# Altium project lyaptsev_control_board.PrjPcb
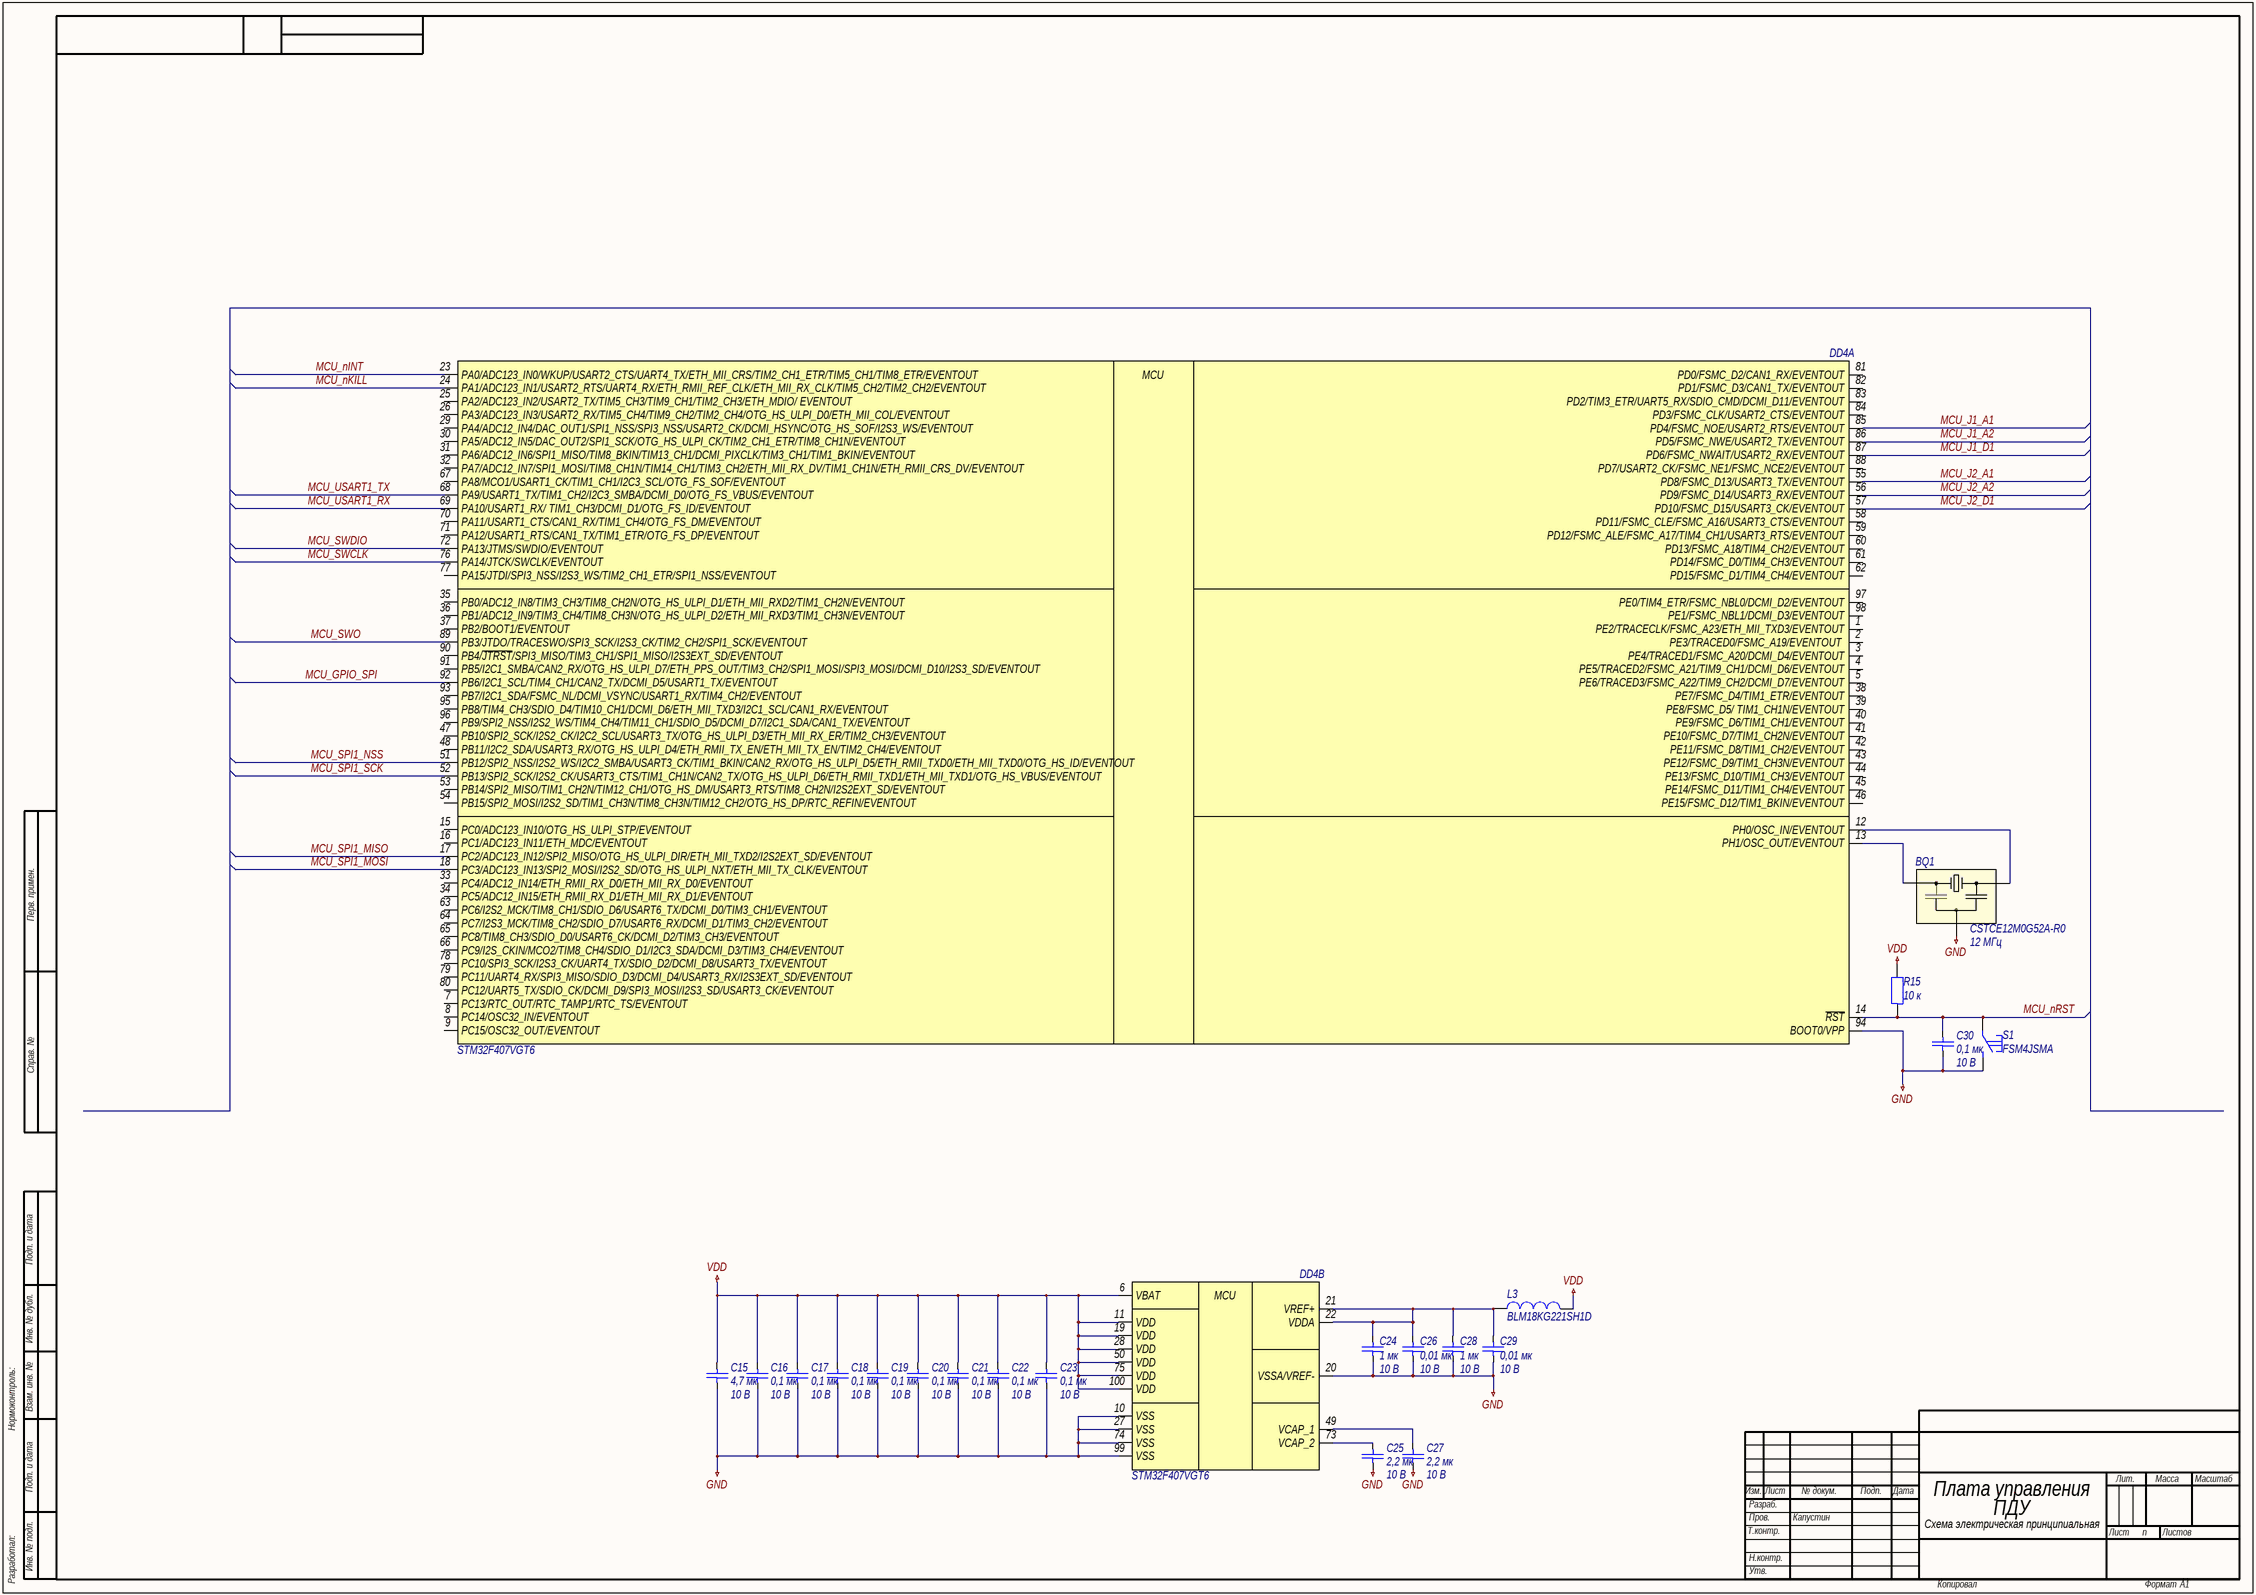
[diagram p0: lyaptsev_control_board_1.SchDoc]
approver: Капустин; check: Капустин; designation: СПБПУ.3331506.016; developer: Ляпцев; document_code: Ý3; document_type: Схема электрическая принципиальная; pcb_dec_number: СПБПУ.3331506.016; project: Плата управления ПДУ; sheets_total: 2; title: Плата управления ПДУ; title_line_1: Плата управления; title_line_2: ПДУ
2 sheets, 68 parts. Net scope: global (net labels, ports and power ports of the same name join across sheets).
Board file: lyaptsev_control_board.PcbDoc
Sheets:
  lyaptsev_control_board_1.SchDoc
  lyaptsev_control_board_2.SchDoc

## Sheet lyaptsev_control_board_1.SchDoc: Плата управления ПДУ
size 840 x 594 mm; ApprovedBy: Капустин; CheckedBy: Капустин; DrawnBy: Ляпцев; DocumentNumber: СПБПУ.3331506.016Ý3; SheetNumber: n; SheetTotal: 2; DocumentCode: Ý3; ImagePath: СПБПУ.3331506.016

### Parts
BQ1  CSTCE12M0G52A-R0  Частотa: 12 МГц  [CSTCE-3-320X130X70]
C15  4,7 мк  Напряжение: 10 В  [C0805]
C16  0,1 мк  Напряжение: 10 В  [C0603]
C17  0,1 мк  Напряжение: 10 В  [C0603]
C18  0,1 мк  Напряжение: 10 В  [C0603]
C19  0,1 мк  Напряжение: 10 В  [C0603]
C20  0,1 мк  Напряжение: 10 В  [C0603]
C21  0,1 мк  Напряжение: 10 В  [C0603]
C22  0,1 мк  Напряжение: 10 В  [C0603]
C23  0,1 мк  Напряжение: 10 В  [C0603]
C24  1 мк  Напряжение: 10 В  [C0603]
C25  2,2 мк  Напряжение: 10 В  [C0603]
C26  0,01 мк  Напряжение: 10 В  [C0603]
C27  2,2 мк  Напряжение: 10 В  [C0603]
C28  1 мк  Напряжение: 10 В  [C0603]
C29  0,01 мк  Напряжение: 10 В  [C0603]
C30  0,1 мк  Напряжение: 10 В  [C0603]
DD4  STM32F407VGT6  [LQFP-100-P50-1400X1400X160-L60X22]  (parts A,B of 2)
L3  BLM18KG221SH1D  [BLM-2-0603]
R15  10 к  [R0603]
S1  FSM4JSMA  [FSM4JSMA]

### Nets
GND: BQ1.2 C15.2 C16.2 C17.2 C18.2 C19.2 C20.2 C21.2 C22.2 C23.2 C24.2 C25.2 C26.2 C27.2 C28.2 C29.2 C30.2 DD4.10(VSS) DD4.20(VSSA/VREF-) DD4.27(VSS) DD4.74(VSS) DD4.94(BOOT0/VPP) DD4.99(VSS) S1.2
VDD: C15.1 C16.1 C17.1 C18.1 C19.1 C20.1 C21.1 C22.1 C23.1 DD4.6(VBAT) DD4.11(VDD) DD4.19(VDD) DD4.28(VDD) DD4.50(VDD) DD4.75(VDD) DD4.100(VDD) L3.2 R15.2
MCU_GPIO_SPI: DD4.92(PB6/I2C1_SCL/TIM4_CH1/CAN2_TX/DCMI_D5/USART1_TX/EVENTOUT)
MCU_J1_A1: DD4.85(PD4/FSMC_NOE/USART2_RTS/EVENTOUT)
MCU_J1_A2: DD4.86(PD5/FSMC_NWE/USART2_TX/EVENTOUT)
MCU_J1_D1: DD4.87(PD6/FSMC_NWAIT/USART2_RX/EVENTOUT)
MCU_J2_A1: DD4.55(PD8/FSMC_D13/USART3_TX/EVENTOUT)
MCU_J2_A2: DD4.56(PD9/FSMC_D14/USART3_RX/EVENTOUT)
MCU_J2_D1: DD4.57(PD10/FSMC_D15/USART3_CK/EVENTOUT)
MCU_nINT: DD4.23(PA0/ADC123_IN0/WKUP/USART2_CTS/UART4_TX/ETH_MII_CRS/TIM2_CH1_ETR/TIM5_CH1/TIM8_ETR/EVENTOUT)
MCU_nKILL: DD4.24(PA1/ADC123_IN1/USART2_RTS/UART4_RX/ETH_RMII_REF_CLK/ETH_MII_RX_CLK/TIM5_CH2/TIM2_CH2/EVENTOUT)
MCU_nRST: C30.1 DD4.14(~{RST}) R15.1 S1.1
MCU_SPI1_MISO: DD4.17(PC2/ADC123_IN12/SPI2_MISO/OTG_HS_ULPI_DIR/ETH_MII_TXD2/I2S2EXT_SD/EVENTOUT)
MCU_SPI1_MOSI: DD4.18(PC3/ADC123_IN13/SPI2_MOSI/I2S2_SD/OTG_HS_ULPI_NXT/ETH_MII_TX_CLK/EVENTOUT)
MCU_SPI1_NSS: DD4.51(PB12/SPI2_NSS/I2S2_WS/I2C2_SMBA/USART3_CK/TIM1_BKIN/CAN2_RX/OTG_HS_ULPI_D5/ETH_RMII_TXD0/ETH_MII_TXD0/OTG_HS_ID/EVENTOUT)
MCU_SPI1_SCK: DD4.52(PB13/SPI2_SCK/I2S2_CK/USART3_CTS/TIM1_CH1N/CAN2_TX/OTG_HS_ULPI_D6/ETH_RMII_TXD1/ETH_MII_TXD1/OTG_HS_VBUS/EVENTOUT)
MCU_SWCLK: DD4.76(PA14/JTCK/SWCLK/EVENTOUT)
MCU_SWDIO: DD4.72(PA13/JTMS/SWDIO/EVENTOUT)
MCU_SWO: DD4.89(PB3/JTDO/TRACESWO/SPI3_SCK/I2S3_CK/TIM2_CH2/SPI1_SCK/EVENTOUT)
MCU_USART1_RX: DD4.69(PA10/USART1_RX/_TIM1_CH3/DCMI_D1/OTG_FS_ID/EVENTOUT)
MCU_USART1_TX: DD4.68(PA9/USART1_TX/TIM1_CH2/I2C3_SMBA/DCMI_D0/OTG_FS_VBUS/EVENTOUT)
NetBQ1_1: BQ1.1 DD4.12(PH0/OSC_IN/EVENTOUT)
NetBQ1_3: BQ1.3 DD4.13(PH1/OSC_OUT/EVENTOUT)
NetC24_1: C24.1 C26.1 C28.1 C29.1 DD4.21(VREF+) DD4.22(VDDA) L3.1
NetC25_1: C25.1 DD4.73(VCAP_2)
NetC27_1: C27.1 DD4.49(VCAP_1)

Not connected (* = marked no-connect by the designer): DD4 1(PE2/TRACECLK/FSMC_A23/ETH_MII_TXD3/EVENTOUT) 2(PE3/TRACED0/FSMC_A19/EVENTOUT_) 3(PE4/TRACED1/FSMC_A20/DCMI_D4/EVENTOUT) 4(PE5/TRACED2/FSMC_A21/TIM9_CH1/DCMI_D6/EVENTOUT) 5(PE6/TRACED3/FSMC_A22/TIM9_CH2/DCMI_D7/EVENTOUT) 7(PC13/RTC_OUT/RTC_TAMP1/RTC_TS/EVENTOUT) 8(PC14/OSC32_IN/EVENTOUT) 9(PC15/OSC32_OUT/EVENTOUT) 15(PC0/ADC123_IN10/OTG_HS_ULPI_STP/EVENTOUT) 16(PC1/ADC123_IN11/ETH_MDC/EVENTOUT) 25(PA2/ADC123_IN2/USART2_TX/TIM5_CH3/TIM9_CH1/TIM2_CH3/ETH_MDIO/_EVENTOUT_) 26(PA3/ADC123_IN3/USART2_RX/TIM5_CH4/TIM9_CH2/TIM2_CH4/OTG_HS_ULPI_D0/ETH_MII_COL/EVENTOUT) 29(PA4/ADC12_IN4/DAC_OUT1/SPI1_NSS/SPI3_NSS/USART2_CK/DCMI_HSYNC/OTG_HS_SOF/I2S3_WS/EVENTOUT) 30(PA5/ADC12_IN5/DAC_OUT2/SPI1_SCK/OTG_HS_ULPI_CK/TIM2_CH1_ETR/TIM8_CH1N/EVENTOUT) 31(PA6/ADC12_IN6/SPI1_MISO/TIM8_BKIN/TIM13_CH1/DCMI_PIXCLK/TIM3_CH1/TIM1_BKIN/EVENTOUT) 32(PA7/ADC12_IN7/SPI1_MOSI/TIM8_CH1N/TIM14_CH1/TIM3_CH2/ETH_MII_RX_DV/TIM1_CH1N/ETH_RMII_CRS_DV/EVENTOUT) 33(PC4/ADC12_IN14/ETH_RMII_RX_D0/ETH_MII_RX_D0/EVENTOUT) 34(PC5/ADC12_IN15/ETH_RMII_RX_D1/ETH_MII_RX_D1/EVENTOUT) 35(PB0/ADC12_IN8/TIM3_CH3/TIM8_CH2N/OTG_HS_ULPI_D1/ETH_MII_RXD2/TIM1_CH2N/EVENTOUT) 36(PB1/ADC12_IN9/TIM3_CH4/TIM8_CH3N/OTG_HS_ULPI_D2/ETH_MII_RXD3/TIM1_CH3N/EVENTOUT) 37(PB2/BOOT1/EVENTOUT) 38(PE7/FSMC_D4/TIM1_ETR/EVENTOUT) 39(PE8/FSMC_D5/_TIM1_CH1N/EVENTOUT) 40(PE9/FSMC_D6/TIM1_CH1/EVENTOUT) 41(PE10/FSMC_D7/TIM1_CH2N/EVENTOUT) 42(PE11/FSMC_D8/TIM1_CH2/EVENTOUT) 43(PE12/FSMC_D9/TIM1_CH3N/EVENTOUT) 44(PE13/FSMC_D10/TIM1_CH3/EVENTOUT) 45(PE14/FSMC_D11/TIM1_CH4/EVENTOUT) 46(PE15/FSMC_D12/TIM1_BKIN/EVENTOUT) 47(PB10/SPI2_SCK/I2S2_CK/I2C2_SCL/USART3_TX/OTG_HS_ULPI_D3/ETH_MII_RX_ER/TIM2_CH3/EVENTOUT) 48(PB11/I2C2_SDA/USART3_RX/OTG_HS_ULPI_D4/ETH_RMII_TX_EN/ETH_MII_TX_EN/TIM2_CH4/EVENTOUT) 53(PB14/SPI2_MISO/TIM1_CH2N/TIM12_CH1/OTG_HS_DM/USART3_RTS/TIM8_CH2N/I2S2EXT_SD/EVENTOUT) 54(PB15/SPI2_MOSI/I2S2_SD/TIM1_CH3N/TIM8_CH3N/TIM12_CH2/OTG_HS_DP/RTC_REFIN/EVENTOUT) 58(PD11/FSMC_CLE/FSMC_A16/USART3_CTS/EVENTOUT) 59(PD12/FSMC_ALE/FSMC_A17/TIM4_CH1/USART3_RTS/EVENTOUT) 60(PD13/FSMC_A18/TIM4_CH2/EVENTOUT) 61(PD14/FSMC_D0/TIM4_CH3/EVENTOUT) 62(PD15/FSMC_D1/TIM4_CH4/EVENTOUT) 63(PC6/I2S2_MCK/TIM8_CH1/SDIO_D6/USART6_TX/DCMI_D0/TIM3_CH1/EVENTOUT) 64(PC7/I2S3_MCK/TIM8_CH2/SDIO_D7/USART6_RX/DCMI_D1/TIM3_CH2/EVENTOUT) 65(PC8/TIM8_CH3/SDIO_D0/USART6_CK/DCMI_D2/TIM3_CH3/EVENTOUT_) 66(PC9/I2S_CKIN/MCO2/TIM8_CH4/SDIO_D1/I2C3_SDA/DCMI_D3/TIM3_CH4/EVENTOUT) 67(PA8/MCO1/USART1_CK/TIM1_CH1/I2C3_SCL/OTG_FS_SOF/EVENTOUT) 70(PA11/USART1_CTS/CAN1_RX/TIM1_CH4/OTG_FS_DM/EVENTOUT) 71(PA12/USART1_RTS/CAN1_TX/TIM1_ETR/OTG_FS_DP/EVENTOUT) 77(PA15/JTDI/SPI3_NSS/I2S3_WS/TIM2_CH1_ETR/SPI1_NSS/EVENTOUT) 78(PC10/SPI3_SCK/I2S3_CK/UART4_TX/SDIO_D2/DCMI_D8/USART3_TX/EVENTOUT_) 79(PC11/UART4_RX/SPI3_MISO/SDIO_D3/DCMI_D4/USART3_RX/I2S3EXT_SD/EVENTOUT) 80(PC12/UART5_TX/SDIO_CK/DCMI_D9/SPI3_MOSI/I2S3_SD/USART3_CK/EVENTOUT) 81(PD0/FSMC_D2/CAN1_RX/EVENTOUT) 82(PD1/FSMC_D3/CAN1_TX/EVENTOUT) 83(PD2/TIM3_ETR/UART5_RX/SDIO_CMD/DCMI_D11/EVENTOUT) 84(PD3/FSMC_CLK/USART2_CTS/EVENTOUT) 88(PD7/USART2_CK/FSMC_NE1/FSMC_NCE2/EVENTOUT) 90(PB4/~{JTRST}/SPI3_MISO/TIM3_CH1/SPI1_MISO/I2S3EXT_SD/EVENTOUT) 91(PB5/I2C1_SMBA/CAN2_RX/OTG_HS_ULPI_D7/ETH_PPS_OUT/TIM3_CH2/SPI1_MOSI/SPI3_MOSI/DCMI_D10/I2S3_SD/EVENTOUT) 93(PB7/I2C1_SDA/FSMC_NL/DCMI_VSYNC/USART1_RX/TIM4_CH2/EVENTOUT) 95(PB8/TIM4_CH3/SDIO_D4/TIM10_CH1/DCMI_D6/ETH_MII_TXD3/I2C1_SCL/CAN1_RX/EVENTOUT) 96(PB9/SPI2_NSS/I2S2_WS/TIM4_CH4/TIM11_CH1/SDIO_D5/DCMI_D7/I2C1_SDA/CAN1_TX/EVENTOUT) 97(PE0/TIM4_ETR/FSMC_NBL0/DCMI_D2/EVENTOUT) 98(PE1/FSMC_NBL1/DCMI_D3/EVENTOUT)

### Notes on the sheet
- Перв. примен.
- Справ. №
- Подп. и дата
- Инв. № дубл.
- Нормоконтроль:
- Взам. инв. №
- Изм.
- Лист
- № докум.
- Подп.
- Дата
- Лит.
- Масса
- Масштаб
- Т.контр.
- Пров.
- Разраб.
- Листов
- Разработал:
- Инв. № подл.
- Н.контр.
- Утв.
- Копировал
- Формат
- А1
- (in symbol dd0001, part A) MCU
- (in symbol dd0001, part B) MCU

### Library data of the parts
BQ1 = bq0001: =Описание; ID: bq0001; Фамилия: Самарин; Описание: Кварцевый резонатор 12 МГц; Производитель: Murata Manufacturing Co., Ltd.; Корпус: 3,20 x 1,30 x 0,70; Наименование: CSTCE12M0G52A-R0; Частота: 12 МГц; HelpURL: https://www.murata.com/en-us/products/productdetail?partno=CSTCE12M0G52A-R0
C15 = c0108: =Описание; ID: c0108; Фамилия: Паньков; Описание: Конденсатор керамический чип 0805 4,7 мкФ 10 В ±10 %; Наименование: CC0805KKX7R6BB475; Производитель: YAGEO Corp.; Отклонение: ±10 %; Рабочие температуры: от –55 °С до +125 °С; Температурный коэффициент емкости: X7R; Корпус: 0805; Номинал: 4,7 мк; Номинальное напряжение: 10 В; HelpURL: https://www.yageo.com/upload/media/product/productsearch/datasheet/mlcc/UPY-GPHC_X7R_6.3V-to-50V_20.pdf
C16-C23 = c0054: =Описание; ID: c0054; Фамилия: Паньков; Описание: Конденсатор керамический чип 0603 100 нФ 10 В ±10 %; Наименование: CC0603KRX7R6BB104; Производитель: YAGEO Corp.; Отклонение: ±10 %; Рабочие температуры: от –55 °С до +125 °С; Температурный коэффициент емкости: X7R; Корпус: 0603; Номинал: 0,1 мк; Номинальное напряжение: 10 В; HelpURL: https://www.yageo.com/upload/media/product/productsearch/datasheet/mlcc/UPY-GPHC_X7R_6.3V-to-50V_20.pdf
C24 C28 = c0086: =Описание; ID: c0086; Фамилия: Паньков; Описание: Конденсатор керамический чип 0603 1 мкФ 10 В ±10 %; Наименование: CC0603KRX7R6BB105; Производитель: YAGEO Corp.; Отклонение: ±10 %; Рабочие температуры: от –55 °С до +125 °С; Температурный коэффициент емкости: X7R; Корпус: 0603; Номинал: 1 мк; Номинальное напряжение: 10 В; HelpURL: https://www.yageo.com/upload/media/product/productsearch/datasheet/mlcc/UPY-GPHC_X7R_6.3V-to-50V_20.pdf
C25 C27 = c0097: =Описание; ID: c0097; Фамилия: Чернов; Описание: Конденсатор керамический чип 0603 2,2 мкФ 10 В ±10 %; Наименование: CC0603KRX7R6BB225; Производитель: YAGEO Corp.; Отклонение: ±10 %; Рабочие температуры: от –55 °С до +125 °С; Температурный коэффициент емкости: X7R; Корпус: 0603; Номинал: 2,2 мк; Номинальное напряжение: 10 В; HelpURL: https://www.yageo.com/upload/media/product/productsearch/datasheet/mlcc/UPY-GPHC_X7R_6.3V-to-50V_20.pdf
C26 C29 = c0033: =Описание; ID: c0033; Фамилия: Паньков; Описание: Конденсатор керамический чип 0603 10 нФ 10 В ±10 %; Наименование: CC0603KRX7R6BB103; Производитель: YAGEO Corp.; Отклонение: ±10 %; Рабочие температуры: от –55 °С до +125 °С; Температурный коэффициент емкости: X7R; Корпус: 0603; Номинал: 0,01 мк; Номинальное напряжение: 10 В; HelpURL: https://www.yageo.com/upload/media/product/productsearch/datasheet/mlcc/UPY-GPHC_X7R_6.3V-to-50V_20.pdf
C30 = c0057: =Описание; ID: c0057; Фамилия: Паньков; Описание: Конденсатор керамический чип 0603 100 нФ 10 В ±10 %; Наименование: CC0603KRX7R6BB104; Производитель: YAGEO Corp.; Отклонение: ±10 %; Рабочие температуры: от –55 °С до +125 °С; Температурный коэффициент емкости: X7R; Корпус: 0603; Номинал: 0,1 мк; Номинальное напряжение: 10 В; HelpURL: https://www.yageo.com/upload/media/product/productsearch/datasheet/mlcc/UPY-GPHC_X7R_6.3V-to-50V_20.pdf
DD4 = dd0001: =Описание; ID: dd0001; Фамилия: Паньков; Описание: ARM Cortex-M4 32-разрядный микроконтроллер 168 МГц 1 Мбайт FLASH-памяти; Производитель: STMicroelectronics; Рабочее напряжение: от 1,8 В до 3,6 В; Максимальная тактовая частота: 168 МГц; Поддерживаемые интерфейсы: CAN, I2C, SDIO, I2S/SPI, UART/USART, USB; Рабочие температуры: от –40 °С до +85 °С; Корпус: LQFP-100; Наименование: STM32F407VGT6; HelpURL: https://www.st.com/en/microcontrollers-microprocessors/stm32f407vg.html
L3 = l0001: =Описание; ID: l0001; Фамилия: Ларионов; Описание: Ферритовая бусина 220 Ом ±25 %; Производитель: Murata Manufacturing Co., Ltd.; Сопротивление, 100 МГц: 220 Ом; Отклонение, 100 МГц: ±25 %; Сопротивление при постоянном токе: 0,05 Ом; Рабочие температуры: от –55 °С до +125 °С; Корпус: 0603; Наименование: BLM18KG221SH1D; HelpURL: https://www.murata.com/en-global/products/productdetail?partno=BLM18KG221SH1%23
R15 = r0105: =Описание; ID: r0105; Фамилия: Самарин; Описание: Резистор чип 0603 10 кОм ±1 % 0,1 Вт; Наименование: RC0603FR-0710KL; Производитель: YAGEO Corp.; Отклонение: ±1 %; Номинальное напряжение: 75 В; Номинальный ток: 1 А; Рабочие температуры: от –55 °С до +155 °С; Корпус: 0603; Примечание: Ряд E24; Номинал: 10 к; HelpURL: https://www.yageo.com/upload/media/product/productsearch/datasheet/rchip/PYu-RC_Group_51_RoHS_L_11.pdf
S1 = s0001: =Описание; ID: s0001; Фамилия: Паньков; Описание: Тактовая кнопка поверхностного монтажа; Производитель: TE Connectivity; Ток нагрузки: 50 мА @ 24 В; Сопротивление контакта: 100 мОм; Количество контактов: 4; Рабочие температуры: от –35 °С до +85 °С; Промывка: Запрещена; Корпус: 6,00 x 6,00 x 4,98; Наименование: FSM4JSMA; HelpURL: https://www.te.com/usa-en/product-4-1437565-1.html

## Sheet lyaptsev_control_board_2.SchDoc: Плата управления ПДУ
size 840 x 594 mm; DocumentCode: Ý3
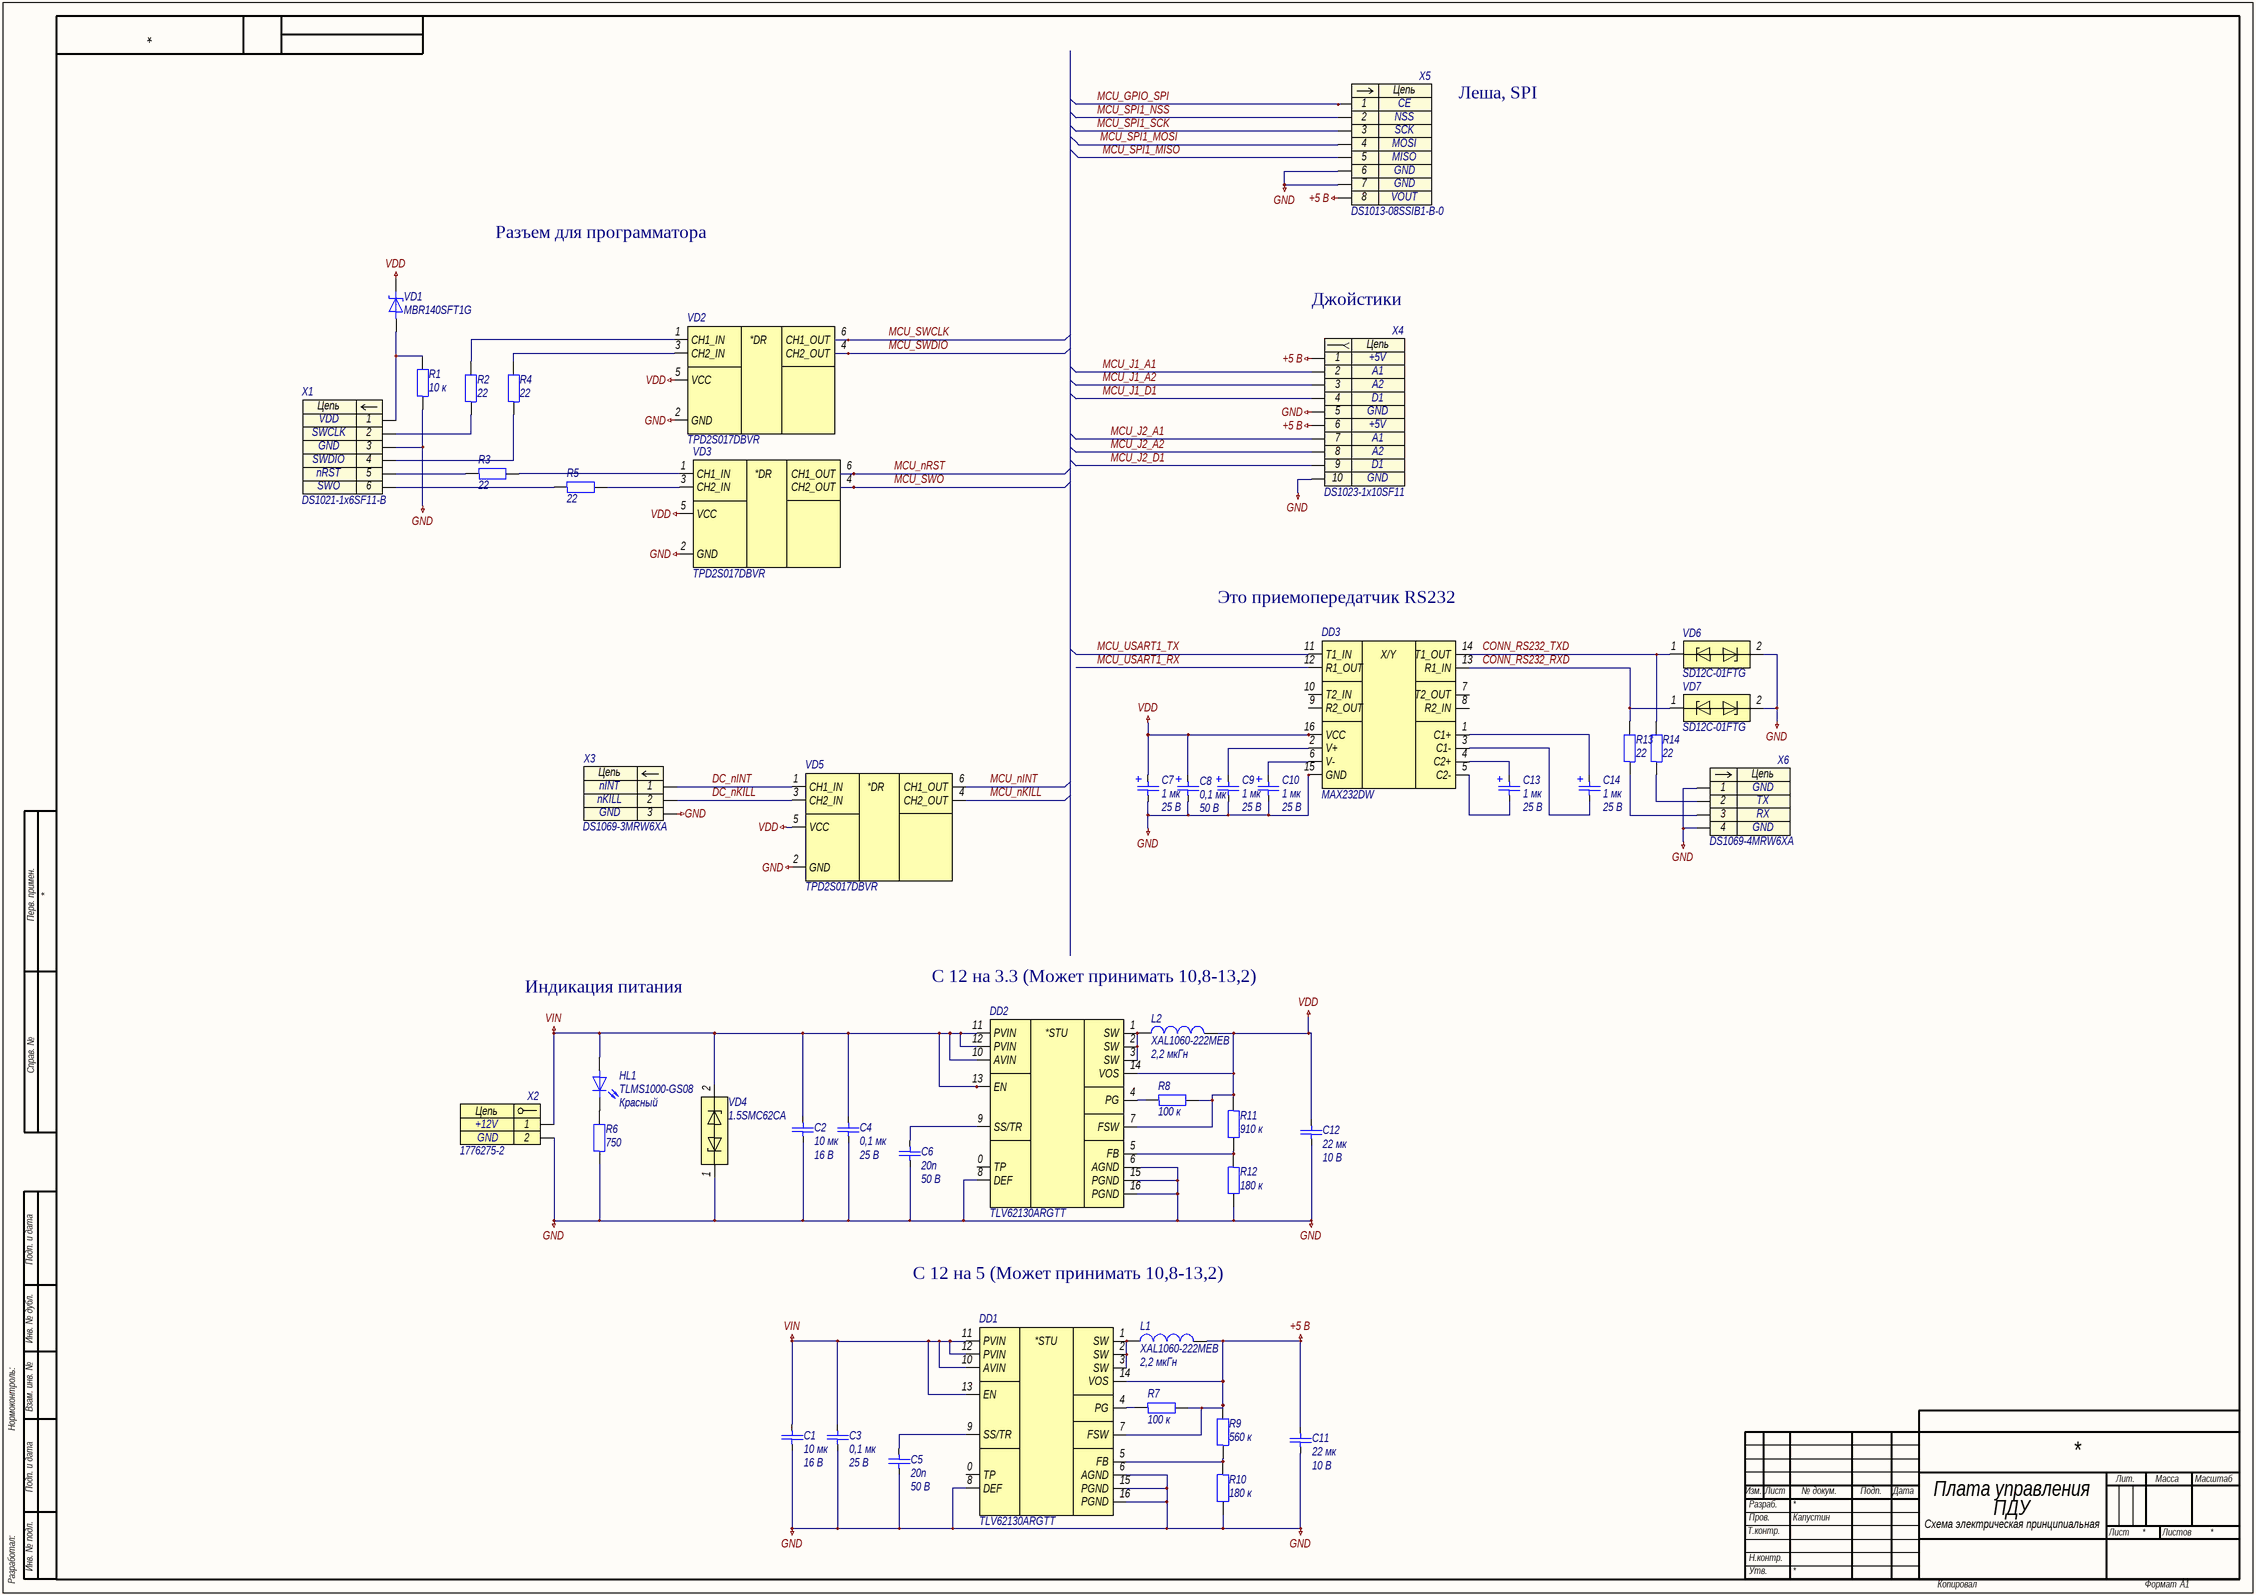
[diagram p1: lyaptsev_control_board_2.SchDoc]

### Parts
C1  10 мк  Напряжение: 16 В  [C0805]
C2  10 мк  Напряжение: 16 В  [C0805]
C3  0,1 мк  Напряжение: 25 В  [C0603]
C4  0,1 мк  Напряжение: 25 В  [C0603]
C5  20п  Напряжение: 50 В  [C0402]
C6  20п  Напряжение: 50 В  [C0402]
C7  1 мк  Напряжение: 25 В  [C3216-18]
C8  0,1 мк  Напряжение: 50 В  [C3216-18]
C9  1 мк  Напряжение: 25 В  [C3216-18]
C10  1 мк  Напряжение: 25 В  [C3216-18]
C11  22 мк  Напряжение: 10 В  [C1206]
C12  22 мк  Напряжение: 10 В  [C1206]
C13  1 мк  Напряжение: 25 В  [C3216-18]
C14  1 мк  Напряжение: 25 В  [C3216-18]
DD1  TLV62130ARGTT  [WQFN-16-P50-300X300X100-L40X24-T168X168]
DD2  TLV62130ARGTT  [WQFN-16-P50-300X300X100-L40X24-T168X168]
DD3  MAX232DW  [SOIC-16-P127-1030X750X265-L84X41]
HL1  TLMS1000-GS08  Цвет: Красный  [HL0603]
L1  XAL1060-222MEB  Индуктивность: 2,2 мкГн  [XAL-2-1130X1000X600]
L2  XAL1060-222MEB  Индуктивность: 2,2 мкГн  [XAL-2-1130X1000X600]
R1  10 к  [R0603]
R2  22  [R0603]
R3  22  [R0603]
R4  22  [R0603]
R5  22  [R0603]
R6  750  [R0603]
R7  100 к  [R0603]
R8  100 к  [R0603]
R9  560 к  [R0603]
R10  180 к  [R0603]
R11  910 к  [R0603]
R12  180 к  [R0603]
R13  22  [R0603]
R14  22  [R0603]
VD1  MBR140SFT1G  [SOD-123FL-370X165X98]
VD2  TPD2S017DBVR  [SOT-23-6-P95-290X280X145]
VD3  TPD2S017DBVR  [SOT-23-6-P95-290X280X145]
VD4  1.5SMC62CA  [DO-214AB-790X590X262]
VD5  TPD2S017DBVR  [SOT-23-6-P95-290X280X145]
VD6  SD12C-01FTG  [SOD-323-257X130X114]
VD7  SD12C-01FTG  [SOD-323-257X130X114]
X1  DS1021-1x6SF11-B  [DS1021-1X6SF11-B]
X2  1776275-2  [1776275-2]
X3  DS1069-3MRW6XA  [DS1069-3MRW6XA]
X4  DS1023-1x10SF11  [DS1023-1X10SF11]
X5  DS1013-08SSIB1-B-0  [DS1013-08SSiB1-B-0]
X6  DS1069-4MRW6XA  [DS1069-4MRW6XA]

### Nets
+5 В: C11.1 DD1.7(FSW) DD1.14(VOS) L1.2 R7.2 R9.2 X4.1 X4.6 X5.8
GND: C1.2 C2.2 C3.2 C4.2 C5.1 C6.1 C7.2 C8.2 C9.2 C10.2 C11.2 C12.2 DD1.6(AGND) DD1.8(DEF) DD1.15(PGND) DD1.16(PGND) DD2.6(AGND) DD2.8(DEF) DD2.15(PGND) DD2.16(PGND) DD3.15(GND) R1.1 R6.1 R10.2 R12.2 VD2.2(GND) VD3.2(GND) VD4.1 VD5.2(GND) VD6.2 VD7.2 X1.3 X2.2 X3.3 X4.5 X4.10 X5.6 X5.7 X6.1 X6.4
VDD: C7.1 C8.1 C12.1 DD2.7(FSW) DD2.14(VOS) DD3.16(VCC) L2.2 R8.2 R11.1 VD1.1 VD2.5(VCC) VD3.5(VCC) VD5.5(VCC)
VIN: C1.1 C2.1 C3.1 C4.1 DD1.10(AVIN) DD1.11(PVIN) DD1.12(PVIN) DD1.13(EN) DD2.10(AVIN) DD2.11(PVIN) DD2.12(PVIN) DD2.13(EN) HL1.2 VD4.2 X2.1
CONN_RS232_RXD: DD3.13(R1_IN) R13.2 VD7.1
CONN_RS232_TXD: DD3.14(T1_OUT) R14.2 VD6.1
DC_nINT: VD5.1(CH1_IN) X3.1
DC_nKILL: VD5.3(CH2_IN) X3.2
MCU_GPIO_SPI: X5.1
MCU_J1_A1: X4.2
MCU_J1_A2: X4.3
MCU_J1_D1: X4.4
MCU_J2_A1: X4.7
MCU_J2_A2: X4.8
MCU_J2_D1: X4.9
MCU_nINT: VD5.6(CH1_OUT)
MCU_nKILL: VD5.4(CH2_OUT)
MCU_nRST: VD3.6(CH1_OUT)
MCU_SPI1_MISO: X5.5
MCU_SPI1_MOSI: X5.4
MCU_SPI1_NSS: X5.2
MCU_SPI1_SCK: X5.3
MCU_SWCLK: VD2.6(CH1_OUT)
MCU_SWDIO: VD2.4(CH2_OUT)
MCU_SWO: VD3.4(CH2_OUT)
MCU_USART1_RX: DD3.12(R1_OUT)
MCU_USART1_TX: DD3.11(T1_IN)
NetC5_2: C5.2 DD1.9(SS/TR)
NetC6_2: C6.2 DD2.9(SS/TR)
NetC9_1: C9.1 DD3.2(V+)
NetC10_1: C10.1 DD3.6(V-)
NetC13_1: C13.1 DD3.4(C2+)
NetC13_2: C13.2 DD3.5(C2-)
NetC14_1: C14.1 DD3.1(C1+)
NetC14_2: C14.2 DD3.3(C1-)
NetDD1_1: DD1.1(SW) DD1.2(SW) DD1.3(SW) L1.1
NetDD1_4: DD1.4(PG) R7.1
NetDD1_5: DD1.5(FB) R9.1 R10.1
NetDD2_1: DD2.1(SW) DD2.2(SW) DD2.3(SW) L2.1
NetDD2_4: DD2.4(PG) R8.1
NetDD2_5: DD2.5(FB) R11.2 R12.1
NetHL1_1: HL1.1 R6.2
NetR1_2: R1.2 VD1.2 X1.1
NetR2_1: R2.1 X1.2
NetR2_2: R2.2 VD2.1(CH1_IN)
NetR3_1: R3.1 X1.5
NetR3_2: R3.2 VD3.1(CH1_IN)
NetR4_1: R4.1 X1.4
NetR4_2: R4.2 VD2.3(CH2_IN)
NetR5_1: R5.1 X1.6
NetR5_2: R5.2 VD3.3(CH2_IN)
NetR13_1: R13.1 X6.3
NetR14_1: R14.1 X6.2

Not connected (* = marked no-connect by the designer): DD1 0(TP); DD2 0(TP); DD3 7(T2_OUT) 8(R2_IN) 9(R2_OUT) 10(T2_IN)

### Notes on the sheet
- Леша, SPI
- Разъем для программатора
- Джойстики
- Это приемопередатчик RS232
- С 12 на 3.3 (Может принимать 10,8-13,2)
- Индикация питания
- С 12 на 5 (Может принимать 10,8-13,2)
- Перв. примен.
- Справ. №
- Подп. и дата
- Инв. № дубл.
- Нормоконтроль:
- Взам. инв. №
- Изм.
- Лист
- № докум.
- Подп.
- Дата
- Лит.
- Масса
- Масштаб
- Т.контр.
- Пров.
- Разраб.
- Листов
- Разработал:
- Инв. № подл.
- Н.контр.
- Утв.
- Копировал
- Формат
- А1
- (in symbol dd0014) X/Y
- (in symbol dd0019) *STU
- (in symbol vd0016) *DR
- (in symbol x0008) Цепь
- (in symbol x0026) Цепь
- (in symbol x0034) Цепь
- (in symbol x0035) Цепь
- (in symbol x0039) Цепь
- (in symbol x0041) Цепь

### Library data of the parts
C1 C2 = c0126: =Описание; ID: c0126; Фамилия: Паньков; Описание: Конденсатор керамический чип 0805 10 мкФ 16 В ±10 %; Наименование: CC0805KKX7R7BB106; Производитель: YAGEO Corp.; Отклонение: ±10 %; Рабочие температуры: от –55 °С до +125 °С; Температурный коэффициент емкости: X7R; Корпус: 0805; Номинал: 10 мк; Номинальное напряжение: 16 В; HelpURL: https://www.yageo.com/upload/media/product/productsearch/datasheet/mlcc/UPY-GPHC_X7R_6.3V-to-50V_20.pdf
C3 C4 = c0063: =Описание; ID: c0063; Фамилия: Паньков; Описание: Конденсатор керамический чип 0603 100 нФ 25 В ±10 %; Наименование: CC0603KRX7R8BB104; Производитель: YAGEO Corp.; Отклонение: ±10 %; Рабочие температуры: от –55 °С до +125 °С; Температурный коэффициент емкости: X7R; Корпус: 0603; Номинал: 0,1 мк; Номинальное напряжение: 25 В; HelpURL: https://www.yageo.com/upload/media/product/productsearch/datasheet/mlcc/UPY-GPHC_X7R_6.3V-to-50V_20.pdf
C5 C6 = с0038: =Описание; ID: с0038; Фамилия: Ляпцев; Описание: Конденсатор чип 0402 20 пФ 25 В ±5 %; Наименование: CC0402JRNPO9BN200; Производитель: YAGEO Corp.; Отклонение: ±5 %; Рабочие температуры: от -55 °С до +85 °С; Корпус: 0402; Номинал: 20п; Номинальное напряжение: 50 В; HelpURL: https://www.yageo.com/upload/media/product/productsearch/datasheet/mlcc/UPY-GP_NP0_16V-to-50V_18.pdf
C7 C9 C10 C13 C14 = c0014: =Описание; ID: c0014; Фамилия: Ларионов; Описание: Конденсатор танталовый чип 3216-18 1 мкФ 25 В ±10 %; Наименование: 293D105X9025A2TE3; Производитель: Vishay Intertechnology, Inc.; Отклонение: ±10 %; Эквивалентное последовательное сопротивление: 7,6 Ом; Среднеквадратичный размах пульсации тока: 0,10 А; Рабочие температуры: от –55 °С до +125 °С; Корпус: 3216-18; Номинал: 1 мк; Номинальное напряжение: 25 В; HelpURL: https://www.vishay.com/capacitors/list/product-40002/
C8 = c0001: =Описание; ID: c0001; Фамилия: Ларионов; Описание: Конденсатор танталовый чип 3216-18 100 нФ 50 В ±10 %; Наименование: 293D104X9050A2TE3; Производитель: Vishay Intertechnology, Inc.; Отклонение: ±10 %; Эквивалентное последовательное сопротивление: 19,0 Ом; Среднеквадратичный размах пульсации тока: 0,06 А; Рабочие температуры: от –55 °С до +125 °С; Корпус: 3216-18; Номинал: 0,1 мк; Номинальное напряжение: 50 В; HelpURL: https://www.vishay.com/capacitors/list/product-40002/
C11 C12 = c0137: =Описание; ID: c0137; Фамилия: Паньков; Описание: Конденсатор керамический чип 1206 22 мкФ 10 В ±10 %; Наименование: CC1206KKX5R6BB226; Производитель: YAGEO Corp.; Отклонение: ±10 %; Рабочие температуры: от –55 °С до +85 °С; Температурный коэффициент емкости: X5R; Корпус: 1206; Номинал: 22 мк; Номинальное напряжение: 10 В; HelpURL: https://www.yageo.com/upload/media/product/productsearch/datasheet/mlcc/UPY-GPHC_X5R_4V-to-50V_26.pdf
DD1 DD2 = dd0019: =Описание; ID: dd0019; Фамилия: Самарин; Описание: Понижающий преобразователь напряжения 17 В и 3 А; Производитель: Texas Instruments Inc.; Входное напряжение: от 3 В до 17 В; Выходное напряжение: от 0,9 до 5,25 В; Коммутируемый ток: до 3 А; Частота переключения: от 1,25 МГц до 2,5 МГц; Рабочие температуры: от –40 °С до +85 °С; Корпус: WQFN-16; Наименование: TLV62130ARGTT; HelpURL: https://www.ti.com/product/TLV62130
DD3 = dd0014: =Описание; ID: dd0014; Фамилия: Паньков; Описание: Приемопередатчик RS-232; Производитель: Texas Instruments Inc.; Рабочие температуры: от 0 до +70 °C; Корпус: SOIC-16; Наименование: MAX232DW; HelpURL: https://www.ti.com/product/MAX232
HL1 = hl0001: =Описание; ID: hl0001; Фамилия: Ларионов; Описание: Светодиод чип 0603 красный; Производитель: Vishay Intertechnology, Inc.; Номинальная сила света: 4 мкд; Номинальная длина волны: 628 нм; Номинальный прямой ток: 15 мА; Номинальное падение напряжения: 1,8 В; Рассеиваемая мощность: 40 мВт; Рабочие температуры: от –40 °С до +100 °С; Корпус: 0603; Наименование: TLMS1000-GS08; HelpURL: https://www.vishay.com/leds/list/product-83172/
L1 L2 = l0002: =Описание; ID: l0002; Фамилия: Ларионов; Описание: Катушка индуктивности 2,2 мкГн ±20 %; Производитель: Coilcraft, Inc.; Отклонение: ±20 %; Номинальное активное сопротивление: 4,5 мОм; Максимальное активное сопротивление: 4,95 мОм; Резонансная частота: 25 МГц; Номинальный ток (при нагреве на 20 °С/40 °С): 13,9 А; Ток насыщения: 32 А; Рабочее напряжение: от 0 В до 60 В; Рабочие температуры: от –40 °С до +125 °С; Корпус: 11,3 x 10,0 x 6,0; Наименование: XAL1060-222MEB; Номинал: 2,2 мкГн; HelpURL: https://www.coilcraft.com/en-us/products/power/shielded-inductors/molded-inductor/xal/xal1060/
R1 = r0105: as R15 on sheet lyaptsev_control_board_1; Номинал: 10 к; HelpURL: https://www.yageo.com/upload/media/product/productsearch/datasheet/rchip/PYu-RC_Group_51_RoHS_L_11.pdf
R2-R5 = r0034: =Описание; ID: r0034; Фамилия: Ларионов; Описание: Резистор чип 0603 22 Ом ±1 % 0,1 Вт; Наименование: RC0603FR-0722RL; Производитель: YAGEO Corp.; Отклонение: ±1 %; Номинальное напряжение: 75 В; Номинальный ток: 1 А; Рабочие температуры: от –55 °С до +155 °С; Корпус: 0603; Примечание: Ряд E24; Номинал: 22; HelpURL: https://www.yageo.com/upload/media/product/productsearch/datasheet/rchip/PYu-RC_Group_51_RoHS_L_11.pdf
R6 = r0028: =Описание; ID: r0028; Фамилия: Паньков; Описание: Резистор чип 0603 750 Ом ±1 % 0,1 Вт; Наименование: RC0603FR-07750RL; Производитель: YAGEO Corp.; Отклонение: ±1 %; Номинальное напряжение: 75 В; Номинальный ток: 1 А; Рабочие температуры: от –55 °С до +155 °С; Корпус: 0603; Примечание: Ряд E24; Номинал: 750; HelpURL: https://www.yageo.com/upload/media/product/productsearch/datasheet/rchip/PYu-RC_Group_51_RoHS_L_11.pdf
R7 R8 = r0141: =Описание; ID: r0141; Фамилия: Водорезов; Описание: Резистор чип 0603 100 кОм ±1 % 0,1 Вт; Наименование: RC0603FR-07100KL; Производитель: YAGEO Corp.; Отклонение: ±1 %; Номинальное напряжение: 75 В; Номинальный ток: 1 А; Рабочие температуры: от –55 °С до +155 °С; Корпус: 0603; Примечание: Ряд E24; Номинал: 100 к; HelpURL: https://www.yageo.com/upload/media/product/productsearch/datasheet/rchip/PYu-RC_Group_51_RoHS_L_11.pdf
R9 = r0167: =Описание; ID: r0167; Фамилия: Паньков; Описание: Резистор чип 0603 560 кОм ±1 % 0,1 Вт; Наименование: RC0603FR-07560KL; Производитель: YAGEO Corp.; Отклонение: ±1 %; Номинальное напряжение: 75 В; Номинальный ток: 1 А; Рабочие температуры: от –55 °С до +155 °С; Корпус: 0603; Примечание: Ряд E24; Номинал: 560 к; HelpURL: https://www.yageo.com/upload/media/product/productsearch/datasheet/rchip/PYu-RC_Group_51_RoHS_L_11.pdf
R10 R12 = r0152: =Описание; ID: r0152; Фамилия: Паньков; Описание: Резистор чип 0603 180 кОм ±1 % 0,1 Вт; Наименование: RC0603FR-07180KL; Производитель: YAGEO Corp.; Отклонение: ±1 %; Номинальное напряжение: 75 В; Номинальный ток: 1 А; Рабочие температуры: от –55 °С до +155 °С; Корпус: 0603; Примечание: Ряд E24; Номинал: 180 к; HelpURL: https://www.yageo.com/upload/media/product/productsearch/datasheet/rchip/PYu-RC_Group_51_RoHS_L_11.pdf
R11 = r0172: =Описание; ID: r0172; Фамилия: Паньков; Описание: Резистор чип 0603 910 кОм ±1 % 0,1 Вт; Наименование: RC0603FR-07910KL; Производитель: YAGEO Corp.; Отклонение: ±1 %; Номинальное напряжение: 75 В; Номинальный ток: 1 А; Рабочие температуры: от –55 °С до +155 °С; Корпус: 0603; Примечание: Ряд E24; Номинал: 910 к; HelpURL: https://www.yageo.com/upload/media/product/productsearch/datasheet/rchip/PYu-RC_Group_51_RoHS_L_11.pdf
R13 R14 = r0004: =Описание; ID: r0004; Фамилия: Ларионов; Описание: Резистор чип 0603 22 Ом ±1 % 0,1 Вт; Наименование: RC0603FR-0722RL; Производитель: YAGEO Corp.; Отклонение: ±1 %; Номинальное напряжение: 75 В; Номинальный ток: 1 А; Рабочие температуры: от –55 °С до +155 °С; Корпус: 0603; Примечание: Ряд E24; Номинал: 22; HelpURL: https://www.yageo.com/upload/media/product/productsearch/datasheet/rchip/PYu-RC_Group_51_RoHS_L_11.pdf
VD1 = vd0002: =Описание; ID: vd0002; Фамилия: Паньков; Описание: Диод Шоттки 40 В 1 А; Производитель: ON Semiconductor; Максимальное прямое напряжение: 0,88 В; Максимальное обратное напряжение: 40 В; Максимальный прямой ток: 1 А; Рабочие температуры: от –55 °С до +125 °С; Корпус: SOD-123FL; Наименование: MBR140SFT1G; HelpURL: https://www.onsemi.com/products/discretes-drivers/diodes-rectifiers/schottky-diodes-schottky-rectifiers/mbr140sf
VD2 VD3 VD5 = vd0016: =Описание; ID: vd0016; Фамилия: Паньков; Описание: Диодная сборка для подавления помех 5 В; Производитель: Texas Instruments Inc.; Корпус: SOT-23-6; Наименование: TPD2S017DBVR; HelpURL: https://www.ti.com/product/TPD2S017
VD4 = vd0009: =Описание; ID: vd0009; Фамилия: Ларионов; Описание: Двунаправленная диодная сборка для подавления помех 53 В; Производитель: Littelfuse, Inc.; Корпус: DO-214AB; Наименование: 1.5SMC62CA; HelpURL: https://www.littelfuse.com/products/tvs-diodes/surface-mount/1_5smc.aspx
VD6 VD7 = vd0004: =Описание; ID: vd0004; Фамилия: Ларионов; Описание: Двунаправленная диодная сборка для подавления помех 12 В; Производитель: Littelfuse, Inc.; Корпус: SOD-323; Наименование: SD12C-01FTG; HelpURL: https://www.littelfuse.com/products/tvs-diode-arrays/general-purpose-esd-protection/sdc/sd12c_01ftg.aspx
X1 = x0026: =Описание; Contact_1: VDD; Contact_2: SWCLK; Contact_3: GND; Contact_4: SWDIO; Contact_5: nRST; Contact_6: SWO; ID: x0026; Фамилия: Паньков; Описание: PLS 6 pin 2,54 мм вилка прямой; Производитель: Connfly Electronic Co., Ltd.; Наименование: DS1021-1x6SF11-B; HelpURL: http://en.connfly.group/product/xVkr=EusQssAN0gN=Aos=mU+UrVkR9kqEAN0gN9g+WqANB+A
X2 = x0008: =Описание; Contact_1: +12V; Contact_2: GND; ID: x0008; Фамилия: Паньков; Описание: Terminal Block 2 pin 3,5 мм; Производитель: TE Connectivity; Наименование: 1776275-2; HelpURL: https://www.te.com/usa-en/product-1776275-2.html
X3 = x0039: =Описание; Contact_1: nINT; Contact_2: nKILL; Contact_3: GND; ID: x0039; Фамилия: Паньков; Описание: CWF 3 pin Type A 2,5 мм вилка угловой; Производитель: Connfly Electronic Co., Ltd.; Наименование: DS1069-3MRW6XA; HelpURL: http://en.connfly.group/product/xVkr=EusQssAN0gN=Aos=mU+UrVkR9kqEAN0gN0MUR+g+NB+A
X4 = x0035: =Описание; Contact_1: +5V; Contact_2: A1; Contact_3: A2; Contact_4: D1; Contact_5: GND; ID: x0035; Фамилия: Паньков; Описание: PBS 10 pin 2,54 мм гнездо прямой; Производитель: Connfly Electronic Co., Ltd.; Contact_6: +5V; Contact_7: A1; Contact_8: A2; Contact_9: D1; Contact_10: GND; Наименование: DS1023-1x10SF11; HelpURL: http://en.connfly.group/product/xVkr=EusQssAN0gN=Aos=mU+UrVkR9kqEAN0gN0AUCUNB+A
X5 = x0034: =Описание; Contact_1: CE; Contact_2: NSS; Contact_3: SCK; Contact_4: MOSI; Contact_5: MISO; Contact_6: GND; Contact_8: VOUT; ID: x0034; Фамилия: Самарин; Описание: Box Header 8 pin 2,54 мм вилка прямой; Производитель: Connfly Electronic Co., Ltd.; Contact_7: GND; Наименование: DS1013-08SSIB1-B-0; HelpURL: http://en.connfly.group/product/xVkr=EusQssAN0gN=Aos=mU+UrVkR9kqEAN0gN9g+Upc+NB+A
X6 = x0041: =Описание; Contact_1: GND; Contact_2: TX; Contact_3: RX; ID: x0041; Фамилия: Паньков; Описание: CWF 4 pin Type A 2,5 мм вилка угловой; Производитель: Connfly Electronic Co., Ltd.; Contact_4: GND; Наименование: DS1069-4MRW6XA; HelpURL: http://en.connfly.group/product/xVkr=EusQssAN0gN=Aos=mU+UrVkR9kqEAN0gN0MUR+g+NB+A

## Nets that join several sheets
GND: lyaptsev_control_board_1 (24 pins), lyaptsev_control_board_2 (40 pins)
VDD: lyaptsev_control_board_1 (18 pins), lyaptsev_control_board_2 (13 pins)
MCU_GPIO_SPI: lyaptsev_control_board_1 (DD4.92), lyaptsev_control_board_2 (X5.1)
MCU_J1_A1: lyaptsev_control_board_1 (DD4.85), lyaptsev_control_board_2 (X4.2)
MCU_J1_A2: lyaptsev_control_board_1 (DD4.86), lyaptsev_control_board_2 (X4.3)
MCU_J1_D1: lyaptsev_control_board_1 (DD4.87), lyaptsev_control_board_2 (X4.4)
MCU_J2_A1: lyaptsev_control_board_1 (DD4.55), lyaptsev_control_board_2 (X4.7)
MCU_J2_A2: lyaptsev_control_board_1 (DD4.56), lyaptsev_control_board_2 (X4.8)
MCU_J2_D1: lyaptsev_control_board_1 (DD4.57), lyaptsev_control_board_2 (X4.9)
MCU_nINT: lyaptsev_control_board_1 (DD4.23), lyaptsev_control_board_2 (VD5.6)
MCU_nKILL: lyaptsev_control_board_1 (DD4.24), lyaptsev_control_board_2 (VD5.4)
MCU_nRST: lyaptsev_control_board_1 (C30.1 DD4.14 R15.1 S1.1), lyaptsev_control_board_2 (VD3.6)
MCU_SPI1_MISO: lyaptsev_control_board_1 (DD4.17), lyaptsev_control_board_2 (X5.5)
MCU_SPI1_MOSI: lyaptsev_control_board_1 (DD4.18), lyaptsev_control_board_2 (X5.4)
MCU_SPI1_NSS: lyaptsev_control_board_1 (DD4.51), lyaptsev_control_board_2 (X5.2)
MCU_SPI1_SCK: lyaptsev_control_board_1 (DD4.52), lyaptsev_control_board_2 (X5.3)
MCU_SWCLK: lyaptsev_control_board_1 (DD4.76), lyaptsev_control_board_2 (VD2.6)
MCU_SWDIO: lyaptsev_control_board_1 (DD4.72), lyaptsev_control_board_2 (VD2.4)
MCU_SWO: lyaptsev_control_board_1 (DD4.89), lyaptsev_control_board_2 (VD3.4)
MCU_USART1_RX: lyaptsev_control_board_1 (DD4.69), lyaptsev_control_board_2 (DD3.12)
MCU_USART1_TX: lyaptsev_control_board_1 (DD4.68), lyaptsev_control_board_2 (DD3.11)